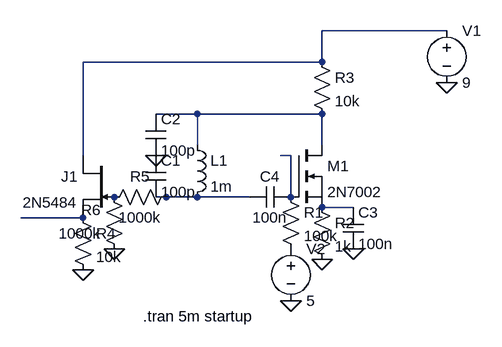
[diagram p0: schematic ThereminOsc.asc]
ThereminOsc.asc, the LTspice schematic file:
Version 4
SHEET 1 880 680
WIRE 432 16 240 16
WIRE 240 64 240 16
WIRE 240 64 -128 64
WIRE 48 144 -16 144
WIRE 240 144 48 144
WIRE 48 192 48 144
WIRE 240 192 240 144
WIRE -128 208 -128 64
WIRE 192 208 176 208
WIRE 0 272 -16 272
WIRE 48 272 0 272
WIRE 128 272 48 272
WIRE 192 272 192 208
WIRE 288 288 240 288
WIRE -128 304 -224 304
FLAG 192 432 0
FLAG 432 96 0
FLAG 240 368 0
FLAG 288 352 0
FLAG -16 208 0
FLAG -128 384 0
FLAG -80 352 0
SYMBOL nmos 192 192 R0
SYMATTR InstName M1
SYMATTR Value 2N7002
SYMBOL cap -32 208 R0
SYMATTR InstName C1
SYMATTR Value 100p
SYMBOL cap -32 144 R0
SYMATTR InstName C2
SYMATTR Value 100p
SYMBOL cap 272 288 R0
SYMATTR InstName C3
SYMATTR Value 100n
SYMBOL cap 192 256 R90
WINDOW 0 0 32 VBottom 2
WINDOW 3 32 32 VTop 2
SYMATTR InstName C4
SYMATTR Value 100n
SYMBOL ind 32 176 R0
SYMATTR InstName L1
SYMATTR Value 1m
SYMBOL res 176 256 R0
SYMATTR InstName R1
SYMATTR Value 100k
SYMBOL res 224 272 R0
SYMATTR InstName R2
SYMATTR Value 1k
SYMBOL res 224 48 R0
SYMATTR InstName R3
SYMATTR Value 10k
SYMBOL voltage 432 0 R0
WINDOW 123 0 0 Left 0
WINDOW 39 0 0 Left 0
SYMATTR InstName V1
SYMATTR Value 9
SYMBOL voltage 192 336 R0
WINDOW 123 0 0 Left 0
WINDOW 39 0 0 Left 0
SYMATTR InstName V2
SYMATTR Value 5
SYMBOL njf -80 208 M0
SYMATTR InstName J1
SYMATTR Value 2N5484
SYMBOL res -144 288 R0
SYMATTR InstName R4
SYMATTR Value 10k
SYMBOL res 16 256 R90
WINDOW 0 0 56 VBottom 2
WINDOW 3 32 56 VTop 2
SYMATTR InstName R5
SYMATTR Value 1000k
SYMBOL res -64 368 R180
WINDOW 0 36 76 Left 2
WINDOW 3 36 40 Left 2
SYMATTR InstName R6
SYMATTR Value 1000k
TEXT -36 456 Left 2 !.tran 5m startup

The netlist it stands for:
* ThereminOsc.asc
M1 N002 N003 N005 N005 2N7002
C1 0 N004 100p
C2 N002 0 100p
C3 N005 0 100n
C4 N003 N004 100n
L1 N002 N004 1m
R1 N003 P001 100k
R2 N005 0 1k
R3 N001 N002 10k
V1 N001 0 9
V2 P001 0 5
J1 N001 P002 N006 2N5484
R4 N006 0 10k
R5 N004 P002 1000k
R6 0 P002 1000k
.model NJF NJF
.model PJF PJF
.lib standard.jft
.model NMOS NMOS
.model PMOS PMOS
.lib standard.mos
.tran 5m startup
.backanno
.end